# Altium schematic sheet MB_fpga_power.SchDoc
size A3
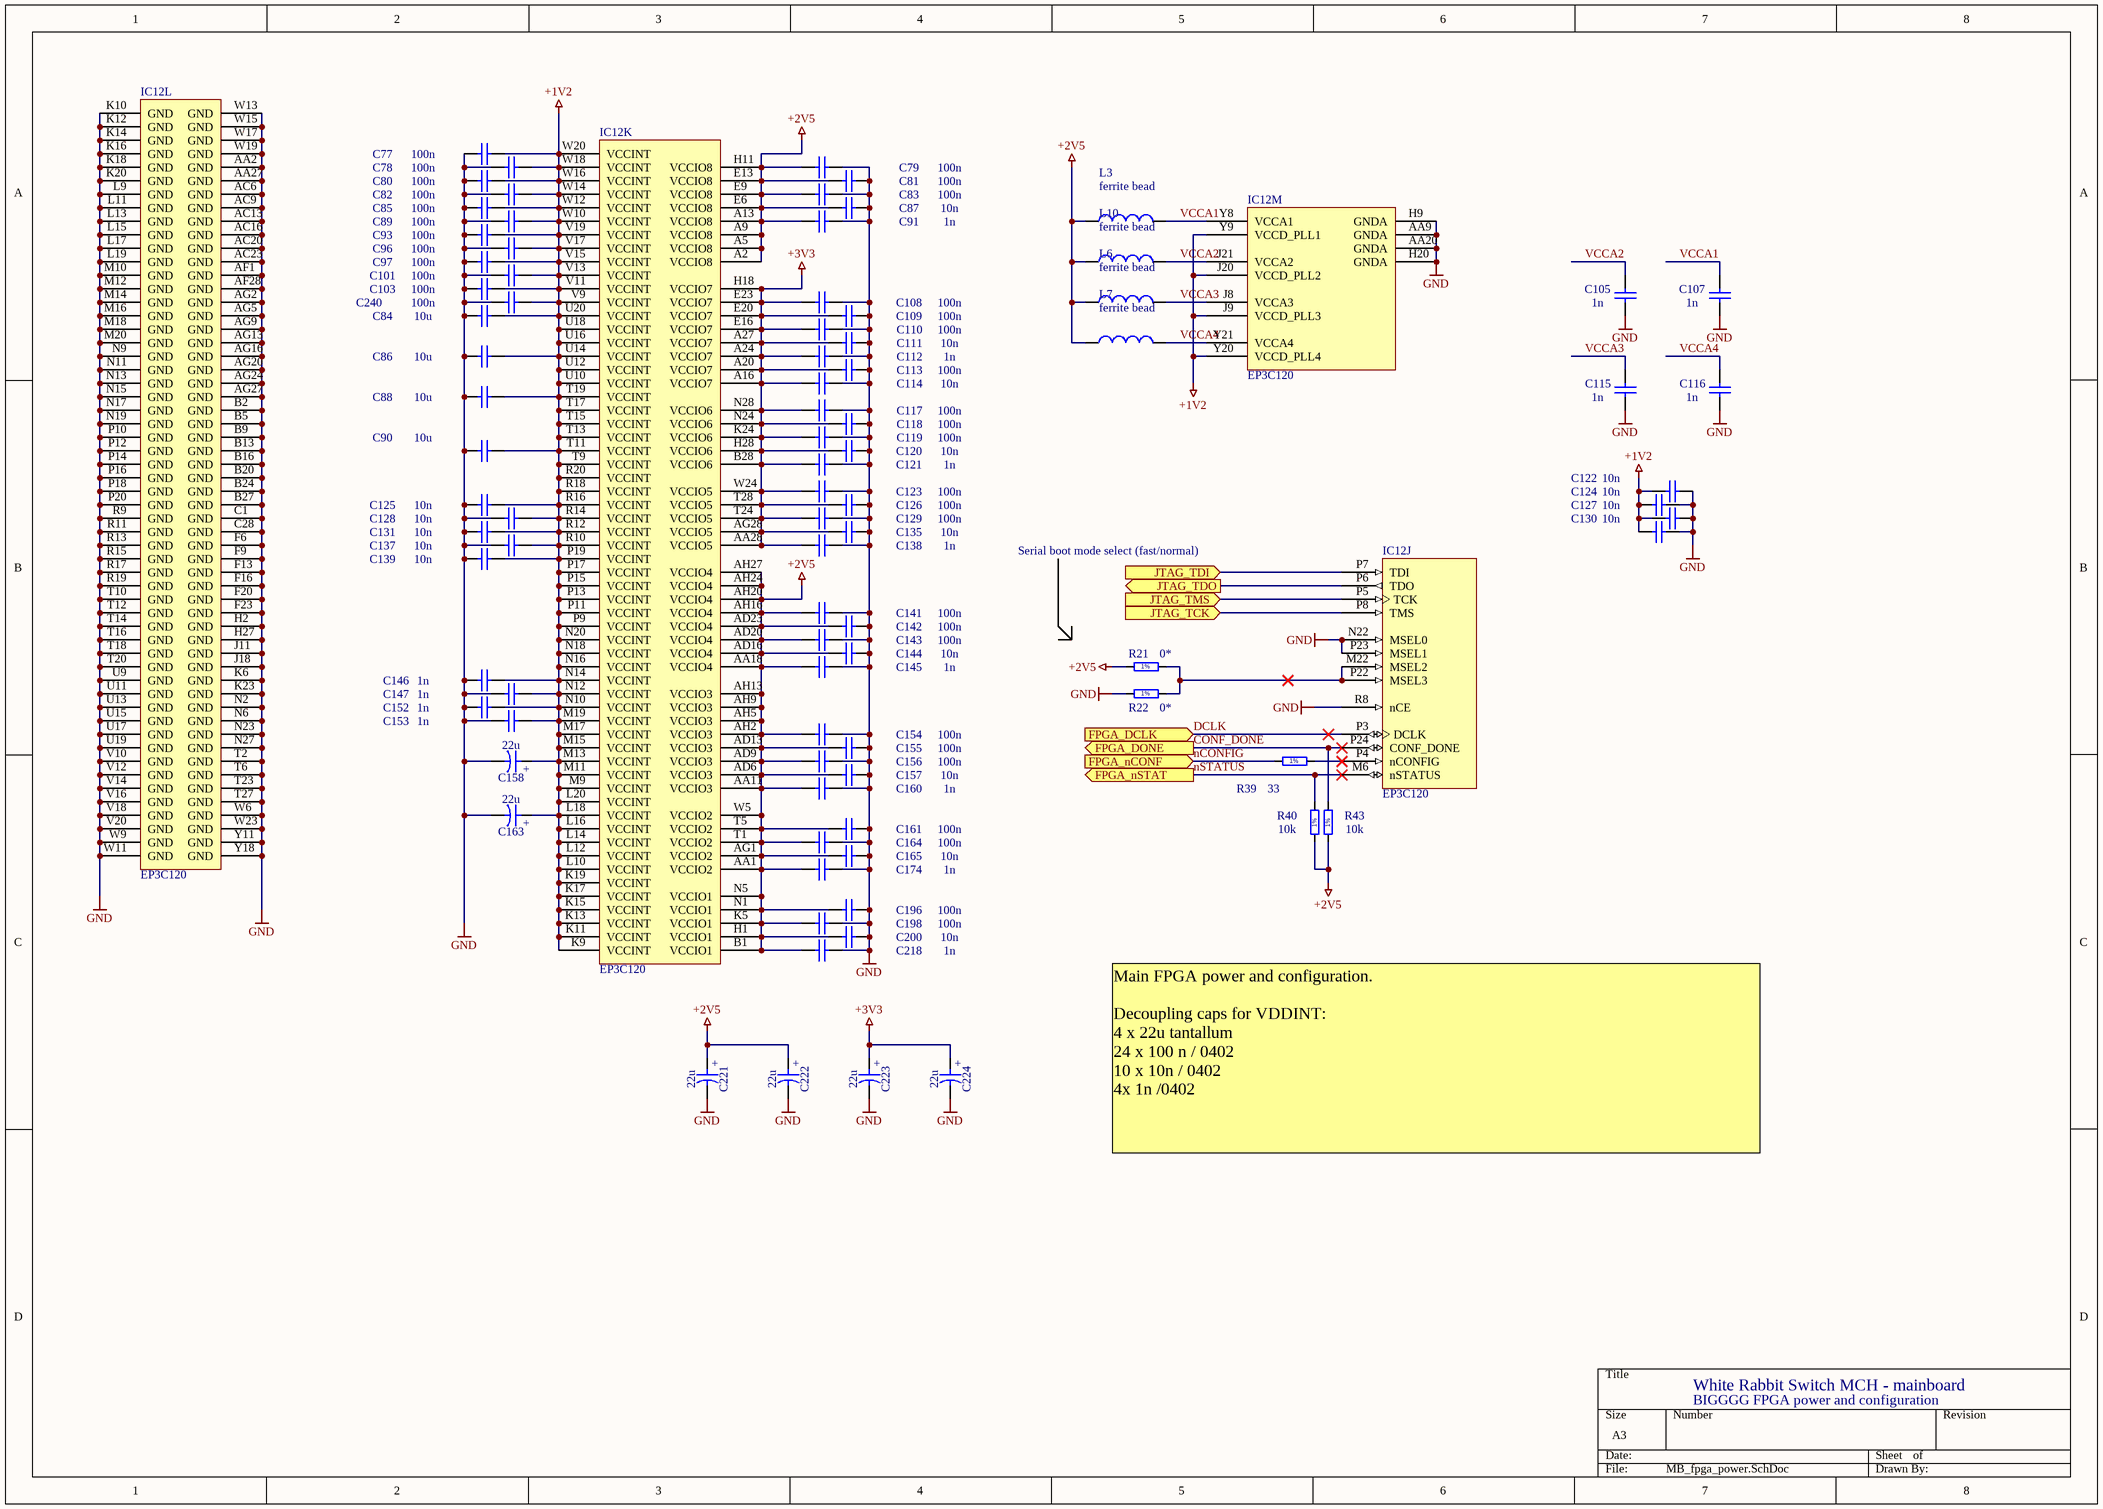
[diagram p0: MB_fpga_power.SchDoc]

## Parts
C77  100n  [CAPC1005X55N]
C78  100n  [CAPC1005X55N]
C79  100n  [CAPC1005X55N]
C80  100n  [CAPC1005X55N]
C81  100n  [CAPC1005X55N]
C82  100n  [CAPC1005X55N]
C83  100n  [CAPC1005X55N]
C84  10u  [CAPC2012X135N]
C85  100n  [CAPC1005X55N]
C86  10u  [CAPC2012X135N]
C87  10n  [CAPC1005X55N]
C88  10u  [CAPC2012X135N]
C89  100n  [CAPC1005X55N]
C90  10u  [CAPC2012X135N]
C91  1n  [CAPC1005X55N]
C93  100n  [CAPC1005X55N]
C96  100n  [CAPC1005X55N]
C97  100n  [CAPC1005X55N]
C101  100n  [CAPC1005X55N]
C103  100n  [CAPC1005X55N]
C105  1n  [CAPC1005X55N]
C107  1n  [CAPC1005X55N]
C108  100n  [CAPC1005X55N]
C109  100n  [CAPC1005X55N]
C110  100n  [CAPC1005X55N]
C111  10n  [CAPC1005X55N]
C112  1n  [CAPC1005X55N]
C113  100n  [CAPC1005X55N]
C114  10n  [CAPC1005X55N]
C115  1n  [CAPC1005X55N]
C116  1n  [CAPC1005X55N]
C117  100n  [CAPC1005X55N]
C118  100n  [CAPC1005X55N]
C119  100n  [CAPC1005X55N]
C120  10n  [CAPC1005X55N]
C121  1n  [CAPC1005X55N]
C122  10n  [CAPC1005X55N]
C123  100n  [CAPC1005X55N]
C124  10n  [CAPC1005X55N]
C125  10n  [CAPC1005X55N]
C126  100n  [CAPC1005X55N]
C127  10n  [CAPC1005X55N]
C128  10n  [CAPC1005X55N]
C129  100n  [CAPC1005X55N]
C130  10n  [CAPC1005X55N]
C131  10n  [CAPC1005X55N]
C135  10n  [CAPC1005X55N]
C137  10n  [CAPC1005X55N]
C138  1n  [CAPC1005X55N]
C139  10n  [CAPC1005X55N]
C141  100n  [CAPC1005X55N]
C142  100n  [CAPC1005X55N]
C143  100n  [CAPC1005X55N]
C144  10n  [CAPC1005X55N]
C145  1n  [CAPC1005X55N]
C146  1n  [CAPC1005X55N]
C147  1n  [CAPC1005X55N]
C152  1n  [CAPC1005X55N]
C153  1n  [CAPC1005X55N]
C154  100n  [CAPC1005X55N]
C155  100n  [CAPC1005X55N]
C156  100n  [CAPC1005X55N]
C157  10n  [CAPC1005X55N]
C158  22u  [CAPMP3216X180N]
C160  1n  [CAPC1005X55N]
C161  100n  [CAPC1005X55N]
C163  22u  [CAPMP3216X180N]
C164  100n  [CAPC1005X55N]
C165  10n  [CAPC1005X55N]
C174  1n  [CAPC1005X55N]
C196  100n  [CAPC1005X55N]
C198  100n  [CAPC1005X55N]
C200  10n  [CAPC1005X55N]
C218  1n  [CAPC1005X55N]
C221  22u  [CAPMP3216X180N]
C222  22u  [CAPMP3216X180N]
C223  22u  [CAPMP3216X180N]
C224  22u  [CAPMP3216X180N]
C240  100n  [CAPC1005X55N]
IC12  EP3C120  [FBGA780-2]  (parts J,K,L,M of 13)
L3  value ferrite bead  [INDC1005-0402]  (hidden comment: Inductor)
L6  value ferrite bead  [INDC1005-0402]  (hidden comment: Inductor)
L7  value ferrite bead  [INDC1005-0402]  (hidden comment: Inductor)
L10  value ferrite bead  [INDC1005-0402]  (hidden comment: Inductor)
R21  0*  [RESC1005X40N]
R22  0*  [RESC1005X40N]
R39  33  [RESC1005X40N]
R40  10k  [RESC1005X40N]
R43  10k  [RESC1005X40N]

## Ports
FPGA_DCLK (in), FPGA_DONE (out), FPGA_nCONF (in), FPGA_nSTAT (out), JTAG_TCK (in), JTAG_TDI (in), JTAG_TDO (out), JTAG_TMS (in)

## Nets
+1V2: C77.2 C78.2 C80.2 C82.2 C84.2 C85.2 C86.2 C88.2 C89.2 C90.2 C93.2 C96.2 C97.2 C101.2 C103.2 C122.1 C124.1 C125.1 C127.1 C128.1 C130.1 C131.1 C137.1 C139.1 C146.1 C147.1 C152.1 C153.1 C158.1 C163.1 C240.2 IC12.J9(VCCD_PLL3) IC12.J20(VCCD_PLL2) IC12.K9(VCCINT) IC12.K11(VCCINT) IC12.K13(VCCINT) IC12.K15(VCCINT) IC12.K17(VCCINT) IC12.K19(VCCINT) IC12.L10(VCCINT) IC12.L12(VCCINT) IC12.L14(VCCINT) IC12.L16(VCCINT) IC12.L18(VCCINT) IC12.L20(VCCINT) IC12.M9(VCCINT) IC12.M11(VCCINT) IC12.M13(VCCINT) IC12.M15(VCCINT) IC12.M17(VCCINT) IC12.M19(VCCINT) IC12.N10(VCCINT) IC12.N12(VCCINT) IC12.N14(VCCINT) IC12.N16(VCCINT) IC12.N18(VCCINT) IC12.N20(VCCINT) IC12.P9(VCCINT) IC12.P11(VCCINT) IC12.P13(VCCINT) IC12.P15(VCCINT) IC12.P17(VCCINT) IC12.P19(VCCINT) IC12.R10(VCCINT) IC12.R12(VCCINT) IC12.R14(VCCINT) IC12.R16(VCCINT) IC12.R18(VCCINT) IC12.R20(VCCINT) IC12.T9(VCCINT) IC12.T11(VCCINT) IC12.T13(VCCINT) IC12.T15(VCCINT) IC12.T17(VCCINT) IC12.T19(VCCINT) IC12.U10(VCCINT) IC12.U12(VCCINT) IC12.U14(VCCINT) IC12.U16(VCCINT) IC12.U18(VCCINT) IC12.U20(VCCINT) IC12.V9(VCCINT) IC12.V11(VCCINT) IC12.V13(VCCINT) IC12.V15(VCCINT) IC12.V17(VCCINT) IC12.V19(VCCINT) IC12.W10(VCCINT) IC12.W12(VCCINT) IC12.W14(VCCINT) IC12.W16(VCCINT) IC12.W18(VCCINT) IC12.W20(VCCINT) IC12.Y9(VCCD_PLL1) IC12.Y20(VCCD_PLL4)
+2V5: C79.1 C81.1 C83.1 C87.1 C91.1 C141.1 C142.1 C143.1 C144.1 C145.1 C154.1 C155.1 C156.1 C157.1 C160.1 C161.1 C164.1 C165.1 C174.1 C196.1 C198.1 C200.1 C218.1 C221.1 C222.1 IC12.A2(VCCIO8) IC12.A5(VCCIO8) IC12.A9(VCCIO8) IC12.A13(VCCIO8) IC12.AA1(VCCIO2) IC12.AA11(VCCIO3) IC12.AA18(VCCIO4) IC12.AD6(VCCIO3) IC12.AD9(VCCIO3) IC12.AD13(VCCIO3) IC12.AD16(VCCIO4) IC12.AD20(VCCIO4) IC12.AD23(VCCIO4) IC12.AG1(VCCIO2) IC12.AH2(VCCIO3) IC12.AH5(VCCIO3) IC12.AH9(VCCIO3) IC12.AH13(VCCIO3) IC12.AH16(VCCIO4) IC12.AH20(VCCIO4) IC12.AH24(VCCIO4) IC12.AH27(VCCIO4) IC12.B1(VCCIO1) IC12.E6(VCCIO8) IC12.E9(VCCIO8) IC12.E13(VCCIO8) IC12.H1(VCCIO1) IC12.H11(VCCIO8) IC12.K5(VCCIO1) IC12.N1(VCCIO1) IC12.N5(VCCIO1) IC12.T1(VCCIO2) IC12.T5(VCCIO2) IC12.W5(VCCIO2) L3.1 L6.1 L7.1 L10.1 R21.1 R40.1 R43.1
+3V3: C108.1 C109.1 C110.1 C111.1 C112.1 C113.1 C114.1 C117.1 C118.1 C119.1 C120.1 C121.1 C123.1 C126.1 C129.1 C135.1 C138.1 C223.1 C224.1 IC12.A16(VCCIO7) IC12.A20(VCCIO7) IC12.A24(VCCIO7) IC12.A27(VCCIO7) IC12.AA28(VCCIO5) IC12.AG28(VCCIO5) IC12.B28(VCCIO6) IC12.E16(VCCIO7) IC12.E20(VCCIO7) IC12.E23(VCCIO7) IC12.H18(VCCIO7) IC12.H28(VCCIO6) IC12.K24(VCCIO6) IC12.N24(VCCIO6) IC12.N28(VCCIO6) IC12.T24(VCCIO5) IC12.T28(VCCIO5) IC12.W24(VCCIO5)
GND: C77.1 C78.1 C79.2 C80.1 C81.2 C82.1 C83.2 C84.1 C85.1 C86.1 C87.2 C88.1 C89.1 C90.1 C91.2 C93.1 C96.1 C97.1 C101.1 C103.1 C105.1 C107.1 C108.2 C109.2 C110.2 C111.2 C112.2 C113.2 C114.2 C115.1 C116.1 C117.2 C118.2 C119.2 C120.2 C121.2 C122.2 C123.2 C124.2 C125.2 C126.2 C127.2 C128.2 C129.2 C130.2 C131.2 C135.2 C137.2 C138.2 C139.2 C141.2 C142.2 C143.2 C144.2 C145.2 C146.2 C147.2 C152.2 C153.2 C154.2 C155.2 C156.2 C157.2 C158.2 C160.2 C161.2 C163.2 C164.2 C165.2 C174.2 C196.2 C198.2 C200.2 C218.2 C221.2 C222.2 C223.2 C224.2 C240.1 IC12.AA2(GND) IC12.AA9(GNDA) IC12.AA20(GNDA) IC12.AA27(GND) IC12.AC6(GND) IC12.AC9(GND) IC12.AC13(GND) IC12.AC16(GND) IC12.AC20(GND) IC12.AC23(GND) IC12.AF1(GND) IC12.AF28(GND) IC12.AG2(GND) IC12.AG5(GND) IC12.AG9(GND) IC12.AG13(GND) IC12.AG16(GND) IC12.AG20(GND) IC12.AG24(GND) IC12.AG27(GND) IC12.B2(GND) IC12.B5(GND) IC12.B9(GND) IC12.B13(GND) IC12.B16(GND) IC12.B20(GND) IC12.B24(GND) IC12.B27(GND) IC12.C1(GND) IC12.C28(GND) IC12.F6(GND) IC12.F9(GND) IC12.F13(GND) IC12.F16(GND) IC12.F20(GND) IC12.F23(GND) IC12.H2(GND) IC12.H9(GNDA) IC12.H20(GNDA) IC12.H27(GND) IC12.J11(GND) IC12.J18(GND) IC12.K6(GND) IC12.K10(GND) IC12.K12(GND) IC12.K14(GND) IC12.K16(GND) IC12.K18(GND) IC12.K20(GND) IC12.K23(GND) IC12.L9(GND) IC12.L11(GND) IC12.L13(GND) IC12.L15(GND) IC12.L17(GND) IC12.L19(GND) IC12.M10(GND) IC12.M12(GND) IC12.M14(GND) IC12.M16(GND) IC12.M18(GND) IC12.M20(GND) IC12.N2(GND) IC12.N6(GND) IC12.N9(GND) IC12.N11(GND) IC12.N13(GND) IC12.N15(GND) IC12.N17(GND) IC12.N19(GND) IC12.N22(MSEL0) IC12.N23(GND) IC12.N27(GND) IC12.P10(GND) IC12.P12(GND) IC12.P14(GND) IC12.P16(GND) IC12.P18(GND) IC12.P20(GND) IC12.P23(MSEL1) IC12.R8(nCE) IC12.R9(GND) IC12.R11(GND) IC12.R13(GND) IC12.R15(GND) IC12.R17(GND) IC12.R19(GND) IC12.T2(GND) IC12.T6(GND) IC12.T10(GND) IC12.T12(GND) IC12.T14(GND) IC12.T16(GND) IC12.T18(GND) IC12.T20(GND) IC12.T23(GND) IC12.T27(GND) IC12.U9(GND) IC12.U11(GND) IC12.U13(GND) IC12.U15(GND) IC12.U17(GND) IC12.U19(GND) IC12.V10(GND) IC12.V12(GND) IC12.V14(GND) IC12.V16(GND) IC12.V18(GND) IC12.V20(GND) IC12.W6(GND) IC12.W9(GND) IC12.W11(GND) IC12.W13(GND) IC12.W15(GND) IC12.W17(GND) IC12.W19(GND) IC12.W23(GND) IC12.Y11(GND) IC12.Y18(GND) R22.1
CONF_DONE: IC12.P24(CONF_DONE) R43.2 ; port FPGA_DONE
DCLK: IC12.P3(DCLK) ; port FPGA_DCLK
JTAG_TCK: IC12.P8(TMS) ; port JTAG_TCK
JTAG_TDI: IC12.P7(TDI) ; port JTAG_TDI
JTAG_TDO: IC12.P6(TDO) ; port JTAG_TDO
JTAG_TMS: IC12.P5(TCK) ; port JTAG_TMS
nCONFIG: R39.1 ; port FPGA_nCONF
nSTATUS: IC12.M6(nSTATUS) R40.2 ; port FPGA_nSTAT
VCCA1: C107.2 IC12.Y8(VCCA1) L3.2
VCCA2: C105.2 IC12.J21(VCCA2) L10.2
VCCA3: C115.2 IC12.J8(VCCA3) L6.2
VCCA4: C116.2 IC12.Y21(VCCA4) L7.2
NetIC12_M22: IC12.M22(MSEL2) IC12.P22(MSEL3) R21.2 R22.2
NetIC12_P4: IC12.P4(nCONFIG) R39.2

## Notes on the sheet
- Serial boot mode select (fast/normal)
- Main FPGA power and configuration.
  Decoupling caps for VDDINT:
  4 x 22u tantallum
  24 x 100 n / 0402
  10 x 10n / 0402
  4x 1n /0402
- White Rabbit Switch MCH - mainboard
- BIGGGG FPGA power and configuration
- (in symbol CTE3216-18_22UF_6.3V_10%_LESR0900) +
- (in symbol R0402_0R_JUMPER) 1%
- (in symbol R0402_10K_1%_0.0625W_100PPM) 1%
- (in symbol R0402_33R_1%_0.0625W_100PPM) 1%

## Library data of the parts
C77-C83 C85 C89 C93 C96 C97 C101 C103 C108-C110 C113 C117-C119 C123 C126 C129 C141-C143 C154-C156 C161 C164 C196 C198 C240 = CC0402_100NF_16V_10%_X7R: Non-polarised capacitor; Part Description: SMD Multilayer Chip Ceramic Capacitor; Manufacturer: GENERIC; Manufacturer1 Part Number: 223878715649; Manufacturer1 Datasheet: \\cern.ch\dfs\Applications\Altium\Datasheets\CC0402_X7R_PHYCOMP.pdf; Value: 100nF; Voltage: 16V; TC: X7R; Tolerance: ±10%; Table: Capacitors SMD; Part Number: CC0402_100NF_16V_10%_X7R; Component Kind: Standard; Component Type: Standard; Designator: Capacitor - non polarized; Library Reference: Capacitor - non polarized; Pin Count: 2; Status: Not Recommended; Manufacturer Part Number: CC0402_100NF_16V_10%_X7R; Case: 0402; Mounted: Yes; Socket: No; SMD: Yes; Manufacturer1 Example: PHYCOMP; Manufacturer1 ComponentHeight: 0.55mm; HelpURL: \\cern.ch\dfs\Applications\Altium\Datasheets\CC0402_X7R_PHYCOMP.pdf; Author: CERN DEM JLC; CreateDate: 12/3/2007; LatestRevisionDate: 12/3/2007
C84 C86 C88 C90 = CC0805_10uF_16V_10%_X5R: Non-polarised capacitor; Part Description: SMD Multilayer Chip Ceramic Capacitor; Manufacturer: GENERIC; Manufacturer1 Part Number: C0805C106K4PAC; Manufacturer1 Datasheet: \\cern.ch\dfs\Applications\Altium\Datasheets\CC1206_X5R_KEMET.pdf; Value: 10uF; Voltage: 16V; TC: X5R; Tolerance: ±10%; Table: Capacitors SMD; Part Number: CC0805_10uF_16V_10%_X5R; Component Kind: Standard; Component Type: Standard; Designator: Capacitor - non polarized; Library Reference: Capacitor - non polarized; Pin Count: 2; Status: Preferred; Manufacturer Part Number: CC0805_10uF_16V_±10%_X5R; Case: 0805; Mounted: Yes; Socket: No; SMD: Yes; Manufacturer1 Example: KEMET; Manufacturer1 ComponentHeight: 1.4mm; HelpURL: \\cern.ch\dfs\Applications\Altium\Datasheets\CC1206_X5R_KEMET.pdf; Author: CERN DEM JLC; CreateDate: 12/3/2007; LatestRevisionDate: 12/3/2007
C87 C111 C114 C120 C122 C124 C125 C127 C128 C130 C131 C135 C137 C139 C144 C157 C165 C200 = CC0402_10NF_16V_10%_X7R: Non-polarised capacitor; Part Description: SMD Multilayer Chip Ceramic Capacitor; Manufacturer: GENERIC; Manufacturer1 Part Number: 223878715636; Manufacturer1 Datasheet: \\cern.ch\dfs\Applications\Altium\Datasheets\CC0402_X7R_PHYCOMP.pdf; Value: 10nF; Voltage: 16V; TC: X7R; Tolerance: ±10%; Table: Capacitors SMD; Part Number: CC0402_10NF_16V_10%_X7R; Component Kind: Standard; Component Type: Standard; Designator: Capacitor - non polarized; Library Reference: Capacitor - non polarized; Pin Count: 2; Status: Not Recommended; Manufacturer Part Number: CC0402_10NF_16V_10%_X7R; Case: 0402; Mounted: Yes; Socket: No; SMD: Yes; Manufacturer1 Example: PHYCOMP; Manufacturer1 ComponentHeight: 0.55mm; HelpURL: \\cern.ch\dfs\Applications\Altium\Datasheets\CC0402_X7R_PHYCOMP.pdf; Author: CERN DEM JLC; CreateDate: 12/3/2007; LatestRevisionDate: 12/3/2007
C91 C105 C107 C112 C115 C116 C121 C138 C145-C147 C152 C153 C160 C174 C218 = CC0402_1.0NF_50V_10%_X7R: Non-polarised capacitor; Part Description: SMD Multilayer Chip Ceramic Capacitor; Manufacturer: GENERIC; Manufacturer1 Part Number: 223858715623; Manufacturer1 Datasheet: \\cern.ch\dfs\Applications\Altium\Datasheets\CC0402_X7R_PHYCOMP.pdf; Value: 1nF; Voltage: 50V; TC: X7R; Tolerance: ±10%; Table: Capacitors SMD; Part Number: CC0402_1.0NF_50V_10%_X7R; Component Kind: Standard; Component Type: Standard; Designator: Capacitor - non polarized; Library Reference: Capacitor - non polarized; Pin Count: 2; Status: Not Recommended; Manufacturer Part Number: CC0402_1.0NF_50V_10%_X7R; Case: 0402; Mounted: Yes; Socket: No; SMD: Yes; Manufacturer1 Example: PHYCOMP; Manufacturer1 ComponentHeight: 0.55mm; HelpURL: \\cern.ch\dfs\Applications\Altium\Datasheets\CC0402_X7R_PHYCOMP.pdf; Author: CERN DEM JLC; CreateDate: 12/3/2007; LatestRevisionDate: 12/3/2007
C158 C163 C221-C224 = CTE3216-18_22UF_6.3V_10%_LESR0900: Polarised capacitor; Part Description: Low ESR 0R9 Solid Tantalum Chip Capacitor; Manufacturer: GENERIC; Manufacturer1 Part Number: TPSA226K006R0900; Manufacturer1 Datasheet: \\cern.ch\dfs\Applications\Altium\Datasheets\CTE-LESR_AVX_TPS.pdf; Value: 22uF; Voltage: 6.3V; Tolerance: ±10%; Table: Capacitors SMD; Part Number: CTE3216-18_22UF_6.3V_10%_LESR0900; Component Kind: Standard; Component Type: Standard; Designator: Capacitor - polarized; Library Reference: Capacitor - polarized; Pin Count: 2; Status: Preferred; Manufacturer Part Number: CTE3216-18_22UF_6.3V_10%_LESR0900; Case: A; Mounted: Yes; Socket: No; SMD: Yes; Manufacturer1 Example: AVX; Manufacturer1 ComponentHeight: 1.8mm; HelpURL: \\cern.ch\dfs\Applications\Altium\Datasheets\CTE-LESR_AVX_TPS.pdf; Author: CERN DEM JLC; CreateDate: 5/5/2008; LatestRevisionDate: 1/20/2009
IC12 = EP3C120F780C7: Cyclone III Family FPGA, 531 I/O Pins, 4 PLLs, 780-Pin FBGA, Speed Grade 7, Commercial Grade; Value: EP3C120F780C8N; RefId: 1635080; Published: 26-Feb-2007; DatasheetVersion: ver1.2, Sep-2007; PackageVersion: ver14.8, Oct-2007; PackageReference: FBGA780-2; Publisher: Altium Limited; PackageDescription: 780-Ball FineLine Ball Grid Array (FBGA780) - Option 2 - Wire Bond; Code_JEDEC: MS-034-AAM-1; ComponentLink1Description: Manufacturer Link; ComponentLink1URL: http://www.altera.com/; ComponentLink2Description: Handbook (7.86MB); ComponentLink2URL: http://www.altera.com/literature/hb/cyc3/cyclone3_handbook.pdf; ComponentLink3Description: Packaging Specification; ComponentLink3URL: http://www.altera.com/literature/ds/dspkg.pdf; Supplier: Farnell
L3 L6 L7 L10 = Inductor: Ferrite bead; Published: 8-Jun-2000; Revision: July-2002: Re-released for DXP Platform.; Publisher: Altium Limited
R21 R22 = R0402_0R_JUMPER: Resistor - 1%; Part Description: 1A (0.05R Max DC Resistance) Zero Ohm Jumper; Manufacturer: GENERIC; Manufacturer1 Part Number: 232270591001; Manufacturer1 Datasheet: \\cern.ch\dfs\Applications\Altium\Datasheets\R0402_Phycomp_RC0402.pdf; Value: 0; Table: Resistors SMD; Part Number: R0402_0R_JUMPER; Component Kind: Standard; Component Type: Standard; Designator: Resistor - 1%; Library Reference: Resistor - 1%; Pin Count: 2; Status: Not recommended; Manufacturer Part Number: R0402_0R_JUMPER; Case: 0402; Mounted: Yes; Socket: No; SMD: Yes; Manufacturer1 Example: PHYCOMP; Manufacturer1 ComponentHeight: 0.4mm; HelpURL: \\cern.ch\dfs\Applications\Altium\Datasheets\R0402_Phycomp_RC0402.pdf; Author: CERN DEM JLC; CreateDate: 12/3/2007; LatestRevisionDate: 3/13/2008
R39 = R0402_33R_1%_0.0625W_100PPM: Resistor - 1%; Part Description: General Purpose Thick Film Chip Resistor; Manufacturer: GENERIC; Manufacturer1 Part Number: 232270673309; Manufacturer1 Datasheet: \\cern.ch\dfs\Applications\Altium\Datasheets\R0402_Phycomp_RC0402.pdf; TC: ±100ppm/°C; Table: Resistors SMD; Part Number: R0402_33R_1%_0.0625W_100PPM; Component Kind: Standard; Component Type: Standard; Designator: Resistor - 1%; Library Reference: Resistor - 1%; Pin Count: 2; Value: 33; Status: Not recommended; Power: 0.0625W; Tolerance: ±1%; Manufacturer Part Number: R0402_33R_1%_0.0625W_100PPM; Case: 0402; Mounted: Yes; Socket: No; SMD: Yes; Manufacturer1 Example: PHYCOMP; Manufacturer1 ComponentHeight: 0.4mm; HelpURL: \\cern.ch\dfs\Applications\Altium\Datasheets\R0402_Phycomp_RC0402.pdf; Author: CERN DEM JLC; CreateDate: 12/3/2007; LatestRevisionDate: 3/13/2008
R40 R43 = R0402_10K_1%_0.0625W_100PPM: Resistor - 1%; Part Description: General Purpose Thick Film Chip Resistor; Manufacturer: GENERIC; Manufacturer1 Part Number: 232270671003; Manufacturer1 Datasheet: \\cern.ch\dfs\Applications\Altium\Datasheets\R0402_Phycomp_RC0402.pdf; TC: ±100ppm/°C; Table: Resistors SMD; Part Number: R0402_10K_1%_0.0625W_100PPM; Component Kind: Standard; Component Type: Standard; Designator: Resistor - 1%; Library Reference: Resistor - 1%; Pin Count: 2; Value: 10k; Status: Not recommended; Power: 0.0625W; Tolerance: ±1%; Manufacturer Part Number: R0402_10K_1%_0.0625W_100PPM; Case: 0402; Mounted: Yes; Socket: No; SMD: Yes; Manufacturer1 Example: PHYCOMP; Manufacturer1 ComponentHeight: 0.4mm; HelpURL: \\cern.ch\dfs\Applications\Altium\Datasheets\R0402_Phycomp_RC0402.pdf; Author: CERN DEM JLC; CreateDate: 12/3/2007; LatestRevisionDate: 3/13/2008